# Altium schematic sheet CON_PWR_HDR8X1.SchDoc: CAN Connector DB9 Male
size A4; Organization: Altium Limited.; Address1: Level 3, 12a Rodborough Rd; Address2: Frenchs Forest 2086; Address3: NSW; Address4: AUSTRALIA; SheetNumber: 1; SheetTotal: 100
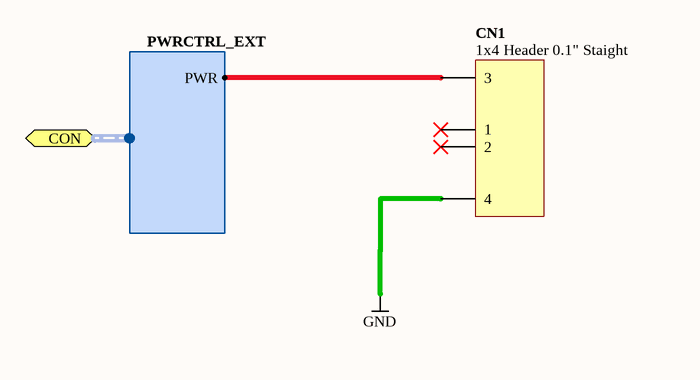
[diagram p0: CON_PWR_HDR8X1.SchDoc]

## Parts
CN1  1x4 Header 0.1" Staight  [HDR1X4]

## Ports
CON (harness PWRCTRL_EXT)

## Harnesses
PWRCTRL_EXT: PWR

## Nets
GND: CN1.4
NetCN1_3: CN1.3 ; port CON.PWR

Not connected (* = marked no-connect by the designer): CN1 1* 2*

## Notes on the sheet
- Sheet Title
- Project Title
- Size:
- Date:
- A4
- Assy:
- Time:
- Revision:
- Sheet
- of
- File:

## Library data of the parts
CN1 = D-300-0064: Header, 1x4, 0.1", Straight, 15mm High; Max Current: mA; Connector type: Header; Mounting Technology: Through-Hole; Status: Production; Category: Connector